# Altium schematic sheet Anemoia-ESP32-SMD.SchDoc: Anemoia-ESP32 (part 2 of 3)
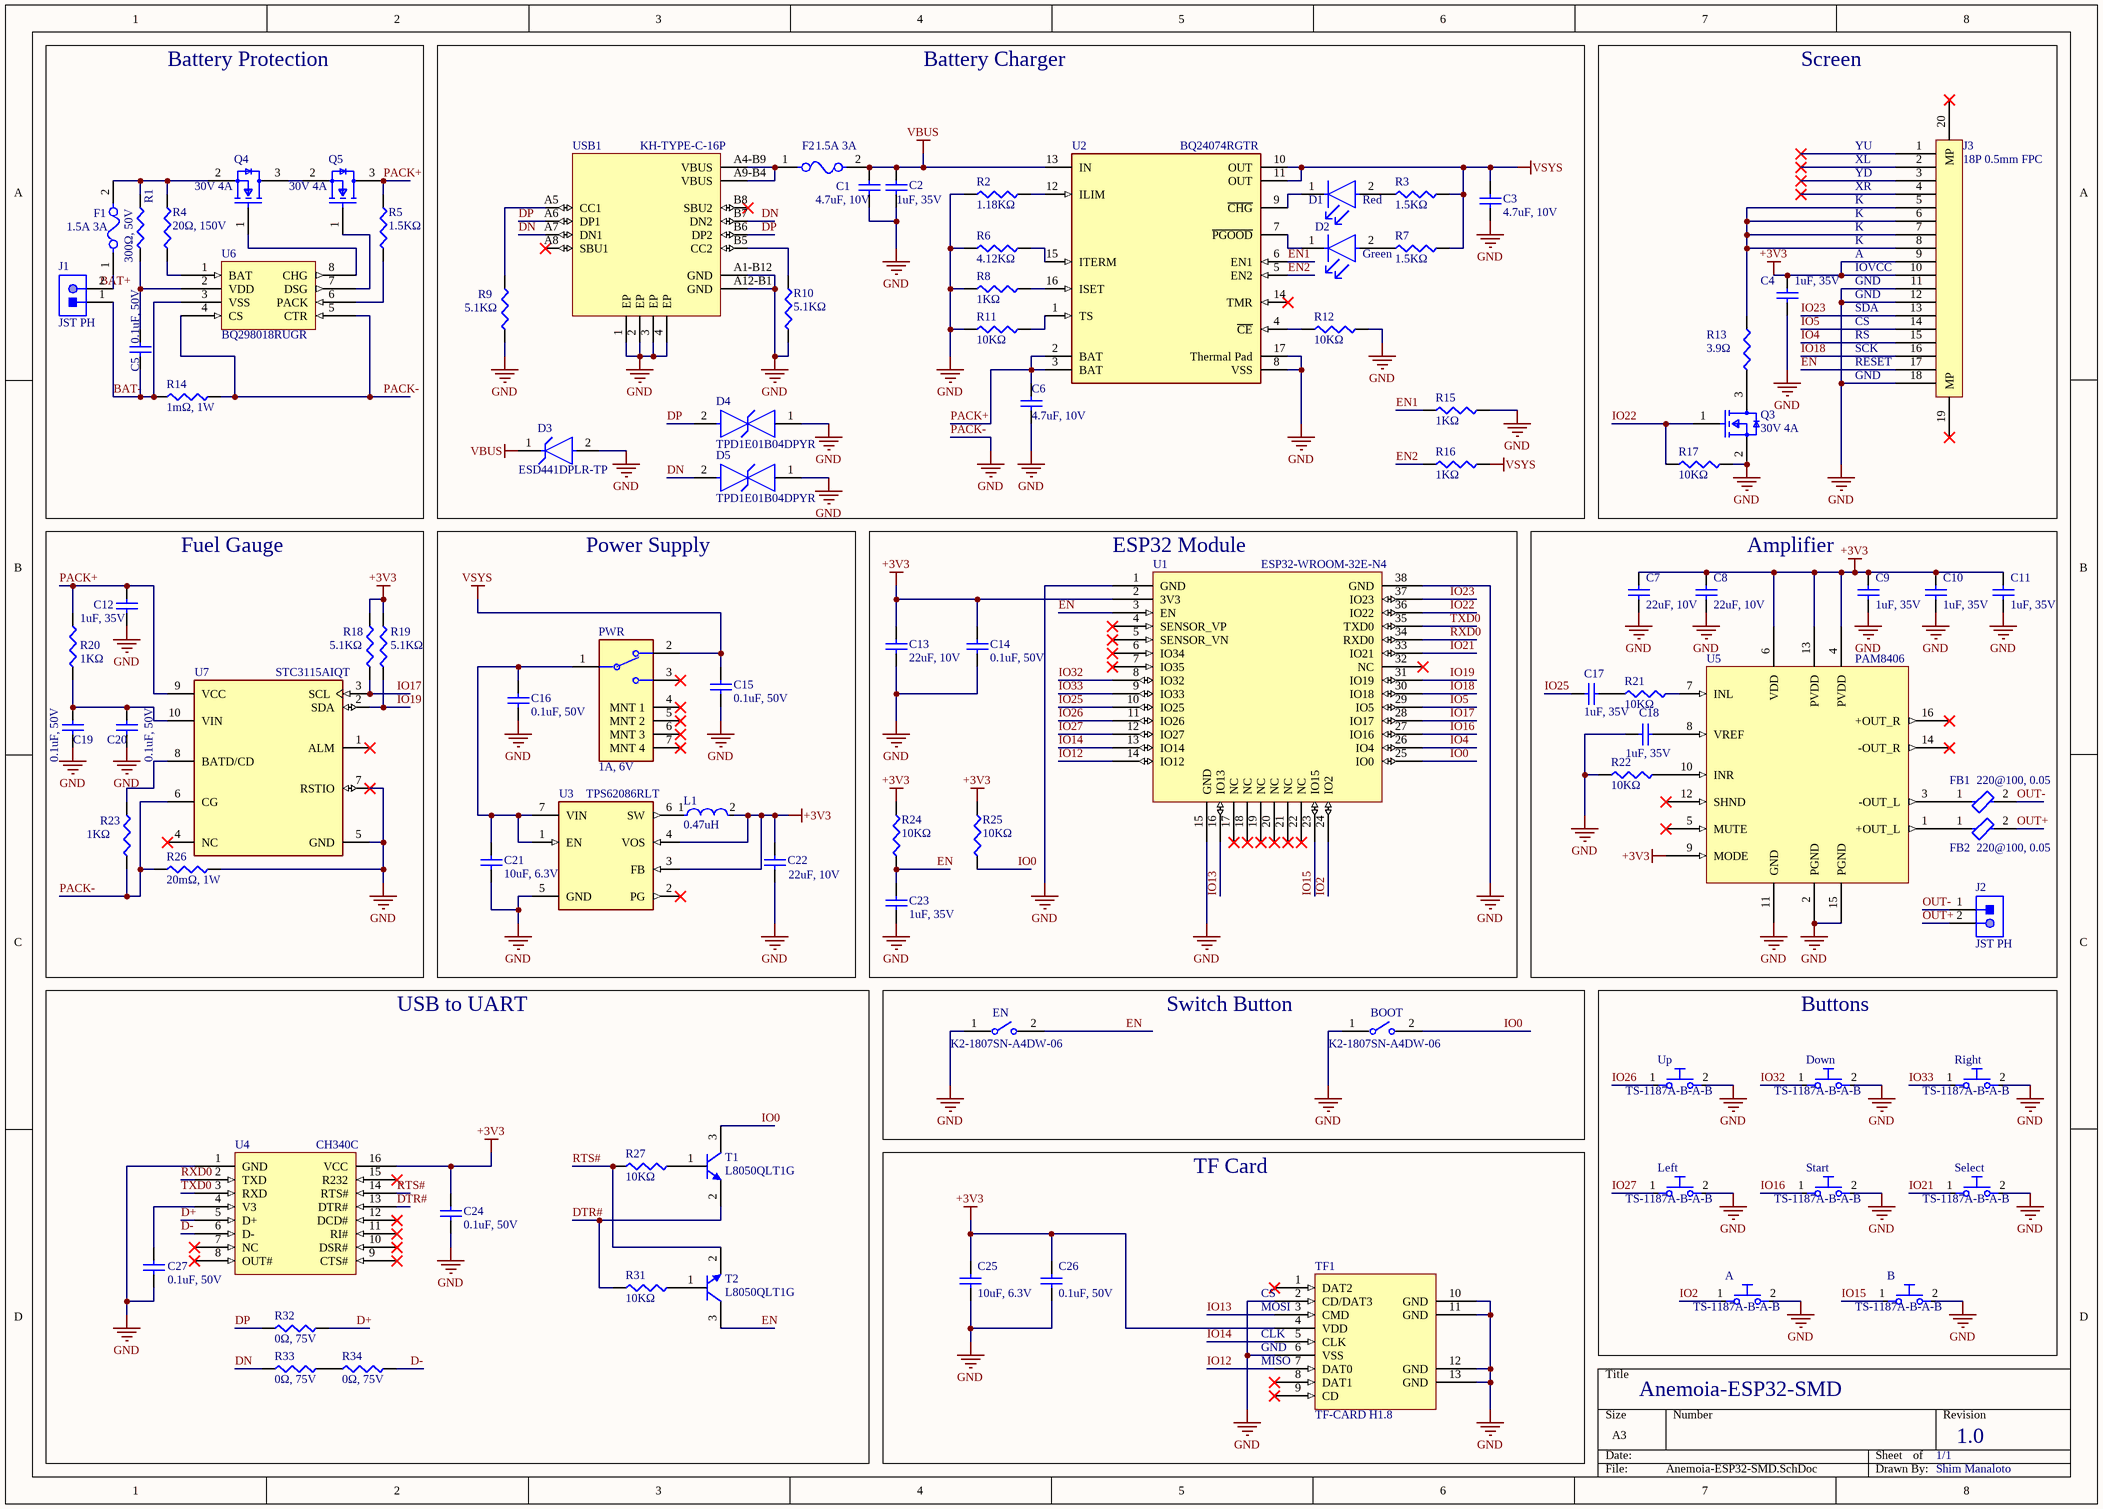
[diagram p1: Anemoia-ESP32-SMD.SchDoc]
## Library data of the parts
A B Down Left Right Select Start Up = TS-1187A-B-A-B: Without Bracket 5.1mm 12V 5.1mm Round Button No SPST 50mA SMD-4P,5.1x5.1mm Tactile Switches RoHS
BOOT EN = K2-1807SN-A4DW-06: 12V 2.9mm 4mm 50mA SMD,4x2.9mm Tactile Switches RoHS
C1 C3 C6 = CL10A475KP8NNNC: CAP CER 4.7uF 10V ±10% X5R 0603; Manufacturer: Samsung Electro-Mechanics; Capacitance: 4.7µF; Dielectric Material: Ceramic; Supplier 1: DigiKey; Manufacturer Part Number: CL10A475KP8NNNC; RoHS: Compliant; Category: Ceramic Capacitors; Stock 1: 3890805; Case/Package: 0603; Case Code (Imperial): 0603; Case Code (Metric): 1608; China RoHS: Compliant; Contact Plating: Tin; Depth: 800µm; Dielectric: X5R; Height: 800µm; Length: 1.6mm; Lifecycle Status: Production; Material: Ceramic; Max Operating Temperature: 85°C; Min Operating Temperature: -55°C; Mount: Surface Mount; Number of Terminals: 2; Radiation Hardening: No; REACH SVHC: Yes; Schedule B: 8532240020, 8532240020|8532240020|8532240020|8532240020|8532240020|8532240020|8532240020|8532240020|8532240020|8532240020|8532240020|8532240020|8532240020|8532240020|8532240020|8532240020|8532240020|8532240020|8532240020|8532240020|8532240020|8532240020|8532240020|85; Thickness: 889µm; Tolerance: 10%; Voltage Rating: 10V; Voltage Rating (DC): 10V; Width: 800µm; ComponentLink1URL: https://datasheet.octopart.com:443/CL10A475KP8NNNC-Samsung-Electro-Mechanics-datasheet-141347107.pdf?src-supplier=IHS; ComponentLink1Description: https://datasheet.octopart.com:443/CL10A475KP8NNNC-Samsung-Electro-Mechanics-datasheet-141347107.pdf?src-supplier=IHS; ComponentLink2URL: https://datasheet.octopart.com/CL10A475KP8NNNC-Samsung-Electro-Mechanics-datasheet-8324245.pdf; ComponentLink2Description: https://datasheet.octopart.com/CL10A475KP8NNNC-Samsung-Electro-Mechanics-datasheet-8324245.pdf; ComponentLink3URL: https://datasheet.octopart.com/CL10A475KP8NNNC-Samsung-Electro-Mechanics-datasheet-97040617.pdf; ComponentLink3Description: https://datasheet.octopart.com/CL10A475KP8NNNC-Samsung-Electro-Mechanics-datasheet-97040617.pdf; ComponentLink4URL: https://datasheet.octopart.com:443/CL10A475KP8NNNC-Samsung-Electro-Mechanics-datasheet-110226306.pdf?src-supplier=Future+Electronics; ComponentLink4Description: https://datasheet.octopart.com:443/CL10A475KP8NNNC-Samsung-Electro-Mechanics-datasheet-110226306.pdf?src-supplier=Future+Electronics; ComponentLink5URL: https://datasheet.octopart.com:443/CL10A475KP8NNNC-Samsung-Electro-Mechanics-datasheet-81461812.pdf?src-supplier=Future+Electronics; ComponentLink5Description: https://datasheet.octopart.com:443/CL10A475KP8NNNC-Samsung-Electro-Mechanics-datasheet-81461812.pdf?src-supplier=Future+Electronics; ComponentLink6URL: https://datasheet.octopart.com:443/CL10A475KP8NNNC-Samsung-datasheet-44382860.pdf?src-supplier=Future+Electronics; ComponentLink6Description: https://datasheet.octopart.com:443/CL10A475KP8NNNC-Samsung-datasheet-44382860.pdf?src-supplier=Future+Electronics; ComponentLink7URL: https://datasheet.octopart.com:443/CL10A475KP8NNNC-Samsung-datasheet-26589134.pdf?src-supplier=Future+Electronics; ComponentLink7Description: https://datasheet.octopart.com:443/CL10A475KP8NNNC-Samsung-datasheet-26589134.pdf?src-supplier=Future+Electronics; ComponentLink8URL: https://datasheet.octopart.com:443/CL10A475KP8NNNC-Samsung-Electro-Mechanics-datasheet-149158807.pdf?src-supplier=Future+Electronics; ComponentLink8Description: https://datasheet.octopart.com:443/CL10A475KP8NNNC-Samsung-Electro-Mechanics-datasheet-149158807.pdf?src-supplier=Future+Electronics; ComponentLink9URL: https://datasheet.octopart.com:443/CL10A475KP8NNNC-Samsung-datasheet-59220082.pdf?src-supplier=TME; ComponentLink9Description: https://datasheet.octopart.com:443/CL10A475KP8NNNC-Samsung-datasheet-59220082.pdf?src-supplier=TME; ComponentLink10URL: https://datasheet.octopart.com:443/CL10A475KP8NNNC-Samsung-Electro-Mechanics-datasheet-11791968.pdf?src-supplier=Arrow+Electronics; ComponentLink10Description: https://datasheet.octopart.com:443/CL10A475KP8NNNC-Samsung-Electro-Mechanics-datasheet-11791968.pdf?src-supplier=Arrow+Electronics
C2 C4 C9-C12 C17 C18 C23 = CL05A105KL5NRNC: CAP CER 1uF 35V ±10% X5R 0402; Manufacturer: Samsung Electro-Mechanics; Manufacturer Part Number: CL05A105KP5NNNC; Capacitance: 1µF; Dielectric Material: Ceramic; Voltage Rating: 10V; Supplier 1: DigiKey; RoHS: Compliant; Category: Ceramic Capacitors; Stock 1: 2577830; Case/Package: 0402; Case Code (Imperial): 0402; Case Code (Metric): 1005; China RoHS: Compliant; Contact Plating: Tin; Depth: 500µm; Dielectric: X5R; Height: 550µm; Length: 1mm; Lifecycle Status: Production; Material: Ceramic; Max Operating Temperature: 85°C; Min Operating Temperature: -55°C; Mount: Surface Mount; Number of Terminals: 2; Radiation Hardening: No; REACH SVHC: Yes; Schedule B: 8532240020, 8532240020|8532240020|8532240020|8532240020|8532240020, 8532240020|8532240020|8532240020|8532240020|8532240020|8532240020, 8532240020|8532240020|8532240020|8532240020|8532240020|8532240020|8532240020; Thickness: 558.8µm; Tolerance: 10%; Voltage Rating (DC): 10V; Width: 500µm; ComponentLink1URL: https://datasheet.octopart.com:443/CL05A105KP5NNNC-Samsung-Electro-Mechanics-datasheet-181960517.pdf?src-supplier=IHS; ComponentLink1Description: https://datasheet.octopart.com:443/CL05A105KP5NNNC-Samsung-Electro-Mechanics-datasheet-181960517.pdf?src-supplier=IHS; ComponentLink2URL: https://datasheet.octopart.com:443/CL05A105KP5NNNC-Samsung-Electro-Mechanics-datasheet-136031721.pdf?src-supplier=Future+Electronics; ComponentLink2Description: https://datasheet.octopart.com:443/CL05A105KP5NNNC-Samsung-Electro-Mechanics-datasheet-136031721.pdf?src-supplier=Future+Electronics; ComponentLink3URL: https://datasheet.octopart.com:443/CL05A105KP5NNNC-Samsung-Electro-Mechanics-datasheet-110226203.pdf?src-supplier=Future+Electronics; ComponentLink3Description: https://datasheet.octopart.com:443/CL05A105KP5NNNC-Samsung-Electro-Mechanics-datasheet-110226203.pdf?src-supplier=Future+Electronics; ComponentLink4URL: https://datasheet.octopart.com:443/CL05A105KP5NNNC-Samsung-Electro-Mechanics-datasheet-81461591.pdf?src-supplier=Future+Electronics; ComponentLink4Description: https://datasheet.octopart.com:443/CL05A105KP5NNNC-Samsung-Electro-Mechanics-datasheet-81461591.pdf?src-supplier=Future+Electronics; ComponentLink5URL: https://datasheet.octopart.com:443/CL05A105KP5NNNC-Samsung-datasheet-42280521.pdf?src-supplier=Future+Electronics; ComponentLink5Description: https://datasheet.octopart.com:443/CL05A105KP5NNNC-Samsung-datasheet-42280521.pdf?src-supplier=Future+Electronics; ComponentLink6URL: https://datasheet.octopart.com:443/CL05A105KP5NNNC-Samsung-datasheet-26589000.pdf?src-supplier=Future+Electronics; ComponentLink6Description: https://datasheet.octopart.com:443/CL05A105KP5NNNC-Samsung-datasheet-26589000.pdf?src-supplier=Future+Electronics; ComponentLink7URL: https://datasheet.octopart.com:443/CL05A105KP5NNNC-Samsung-datasheet-8326907.pdf?src-supplier=Future+Electronics; ComponentLink7Description: https://datasheet.octopart.com:443/CL05A105KP5NNNC-Samsung-datasheet-8326907.pdf?src-supplier=Future+Electronics; ComponentLink8URL: https://datasheet.octopart.com:443/CL05A105KP5NNNC-Samsung-Electro-Mechanics-datasheet-149136634.pdf?src-supplier=Future+Electronics; ComponentLink8Description: https://datasheet.octopart.com:443/CL05A105KP5NNNC-Samsung-Electro-Mechanics-datasheet-149136634.pdf?src-supplier=Future+Electronics; ComponentLink9URL: https://datasheet.octopart.com/CL05A105KP5NNNC-Samsung-Electro-Mechanics-datasheet-97040617.pdf; ComponentLink9Description: https://datasheet.octopart.com/CL05A105KP5NNNC-Samsung-Electro-Mechanics-datasheet-97040617.pdf; ComponentLink10URL: https://datasheet.octopart.com/CL05A105KP5NNNC-Samsung-Electro-Mechanics-datasheet-8324245.pdf; ComponentLink10Description: https://datasheet.octopart.com/CL05A105KP5NNNC-Samsung-Electro-Mechanics-datasheet-8324245.pdf; ComponentLink11URL: https://datasheet.octopart.com:443/CL05A105KP5NNNC-Samsung-Electro-Mechanics-datasheet-11789578.pdf?src-supplier=Arrow+Electronics; ComponentLink11Description: https://datasheet.octopart.com:443/CL05A105KP5NNNC-Samsung-Electro-Mechanics-datasheet-11789578.pdf?src-supplier=Arrow+Electronics; ComponentLink12URL: https://datasheet.octopart.com:443/CL05A105KP5NNNC-Samsung-datasheet-59220082.pdf?src-supplier=TME; ComponentLink12Description: https://datasheet.octopart.com:443/CL05A105KP5NNNC-Samsung-datasheet-59220082.pdf?src-supplier=TME
C5 C14-C16 C19 C20 C24 C26 C27 = CC0603KRX7R9BB104: CAP CER 0.1UF 50V X7R 0603; Manufacturer: Yageo Group; Capacitance: 100nF; Dielectric Material: Ceramic; Tolerance: 10%; Supplier 1: DigiKey; Manufacturer Part Number: CC0603KRX7R9BB104; RoHS: Compliant; Category: Ceramic Capacitors; Stock 1: 2259638; Case/Package: 0603; Case Code (Imperial): 0603; Case Code (Metric): 1608; China RoHS: Compliant; Depth: 800µm; Dielectric: X7R; Halogen Free: Halogen Free; Height: 800µm; Lead Free: Lead Free; Length: 1.6mm; Lifecycle Status: Production; Material: Ceramic; Max Operating Temperature: 125°C; Min Operating Temperature: -55°C; Mount: Surface Mount; Number of Pins: 2; Number of Terminals: 2; Radiation Hardening: No; REACH SVHC: Yes; Schedule B: 8532240020, 8532240020|8532240020, 8532240020|8532240020|8532240020, 8532240020|8532240020|8532240020|8532240020; Termination: SMD/SMT; Thickness: 889µm; Voltage: 50V; Voltage Rating: 50V; Voltage Rating (DC): 50V; Width: 800µm; ComponentLink1URL: https://datasheet.octopart.com:443/CC0603KRX7R9BB104-Yageo-datasheet-177165144.pdf?src-supplier=IHS; ComponentLink1Description: https://datasheet.octopart.com:443/CC0603KRX7R9BB104-Yageo-datasheet-177165144.pdf?src-supplier=IHS; ComponentLink2URL: https://datasheet.octopart.com:443/CC0603KRX7R9BB104-Yageo-datasheet-82288757.pdf?src-supplier=Upverter; ComponentLink2Description: https://datasheet.octopart.com:443/CC0603KRX7R9BB104-Yageo-datasheet-82288757.pdf?src-supplier=Upverter; ComponentLink3URL: https://datasheet.octopart.com:443/CC0603KRX7R9BB104-Yageo-datasheet-68298032.pdf?src-supplier=Upverter; ComponentLink3Description: https://datasheet.octopart.com:443/CC0603KRX7R9BB104-Yageo-datasheet-68298032.pdf?src-supplier=Upverter; ComponentLink4URL: https://datasheet.octopart.com/CC0603KRX7R9BB104-Yageo-datasheet-10883670.pdf; ComponentLink4Description: https://datasheet.octopart.com/CC0603KRX7R9BB104-Yageo-datasheet-10883670.pdf; ComponentLink5URL: https://datasheet.octopart.com/CC0603KRX7R9BB104-Yageo-datasheet-12526321.pdf; ComponentLink5Description: https://datasheet.octopart.com/CC0603KRX7R9BB104-Yageo-datasheet-12526321.pdf; ComponentLink6URL: https://datasheet.octopart.com:443/CC0603KRX7R9BB104-Yageo-datasheet-181968726.pdf?src-supplier=Newark; ComponentLink6Description: https://datasheet.octopart.com:443/CC0603KRX7R9BB104-Yageo-datasheet-181968726.pdf?src-supplier=Newark; ComponentLink7URL: https://datasheet.octopart.com:443/CC0603KRX7R9BB104-Yageo-datasheet-499490.pdf?src-supplier=Newark; ComponentLink7Description: https://datasheet.octopart.com:443/CC0603KRX7R9BB104-Yageo-datasheet-499490.pdf?src-supplier=Newark; ComponentLink8URL: https://datasheet.octopart.com:443/CC0603KRX7R9BB104-Yageo-datasheet-62336348.pdf?src-supplier=Newark; ComponentLink8Description: https://datasheet.octopart.com:443/CC0603KRX7R9BB104-Yageo-datasheet-62336348.pdf?src-supplier=Newark; ComponentLink9URL: https://datasheet.octopart.com:443/CC0603KRX7R9BB104-Yageo-datasheet-147453679.pdf?src-supplier=Newark; ComponentLink9Description: https://datasheet.octopart.com:443/CC0603KRX7R9BB104-Yageo-datasheet-147453679.pdf?src-supplier=Newark; ComponentLink10URL: https://datasheet.octopart.com:443/CC0603KRX7R9BB104-Yageo-datasheet-151948686.pdf?src-supplier=Farnell; ComponentLink10Description: https://datasheet.octopart.com:443/CC0603KRX7R9BB104-Yageo-datasheet-151948686.pdf?src-supplier=Farnell; ComponentLink11URL: https://datasheet.octopart.com:443/CC0603KRX7R9BB104-Yageo-datasheet-500777.pdf?src-supplier=Farnell; ComponentLink11Description: https://datasheet.octopart.com:443/CC0603KRX7R9BB104-Yageo-datasheet-500777.pdf?src-supplier=Farnell; ComponentLink12URL: https://datasheet.octopart.com:443/CC0603KRX7R9BB104-Yageo-datasheet-166511530.pdf?src-supplier=Future+Electronics; ComponentLink12Description: https://datasheet.octopart.com:443/CC0603KRX7R9BB104-Yageo-datasheet-166511530.pdf?src-supplier=Future+Electronics; ComponentLink13URL: https://datasheet.octopart.com:443/CC0603KRX7R9BB104-Yageo-datasheet-137700082.pdf?src-supplier=Future+Electronics; ComponentLink13Description: https://datasheet.octopart.com:443/CC0603KRX7R9BB104-Yageo-datasheet-137700082.pdf?src-supplier=Future+Electronics; ComponentLink14URL: https://datasheet.octopart.com:443/CC0603KRX7R9BB104-Yageo-datasheet-137700084.pdf?src-supplier=Future+Electronics; ComponentLink14Description: https://datasheet.octopart.com:443/CC0603KRX7R9BB104-Yageo-datasheet-137700084.pdf?src-supplier=Future+Electronics; ComponentLink15URL: https://datasheet.octopart.com:443/CC0603KRX7R9BB104-Yageo-datasheet-27626582.pdf?src-supplier=Future+Electronics; ComponentLink15Description: https://datasheet.octopart.com:443/CC0603KRX7R9BB104-Yageo-datasheet-27626582.pdf?src-supplier=Future+Electronics; ComponentLink16URL: https://datasheet.octopart.com:443/CC0603KRX7R9BB104-Yageo-datasheet-15895757.pdf?src-supplier=Future+Electronics; ComponentLink16Description: https://datasheet.octopart.com:443/CC0603KRX7R9BB104-Yageo-datasheet-15895757.pdf?src-supplier=Future+Electronics; ComponentLink17URL: https://datasheet.octopart.com:443/CC0603KRX7R9BB104-Yageo-datasheet-8324192.pdf?src-supplier=Future+Electronics; ComponentLink17Description: https://datasheet.octopart.com:443/CC0603KRX7R9BB104-Yageo-datasheet-8324192.pdf?src-supplier=Future+Electronics; ComponentLink18URL: https://datasheet.octopart.com:443/CC0603KRX7R9BB104-Yageo-datasheet-178019014.pdf?src-supplier=Burklin+Elektronik; ComponentLink18Description: https://datasheet.octopart.com:443/CC0603KRX7R9BB104-Yageo-datasheet-178019014.pdf?src-supplier=Burklin+Elektronik; ComponentLink19URL: https://datasheet.octopart.com:443/CC0603KRX7R9BB104-Yageo-Group-datasheet-165992755.pdf?src-supplier=ODG+(Origin+Data+Global); ComponentLink19Description: https://datasheet.octopart.com:443/CC0603KRX7R9BB104-Yageo-Group-datasheet-165992755.pdf?src-supplier=ODG+(Origin+Data+Global); ComponentLink20URL: https://datasheet.octopart.com:443/CC0603KRX7R9BB104-Yageo-datasheet-140260305.pdf?src-supplier=SOS+electronic; ComponentLink20Description: https://datasheet.octopart.com:443/CC0603KRX7R9BB104-Yageo-datasheet-140260305.pdf?src-supplier=SOS+electronic; ComponentLink21URL: https://datasheet.octopart.com:443/CC0603KRX7R9BB104-Yageo-datasheet-120101875.pdf?src-supplier=Megastar; ComponentLink21Description: https://datasheet.octopart.com:443/CC0603KRX7R9BB104-Yageo-datasheet-120101875.pdf?src-supplier=Megastar; ComponentLink22URL: https://datasheet.octopart.com:443/CC0603KRX7R9BB104-Yageo-datasheet-8701427.pdf?src-supplier=element14; ComponentLink22Description: https://datasheet.octopart.com:443/CC0603KRX7R9BB104-Yageo-datasheet-8701427.pdf?src-supplier=element14; ComponentLink23URL: https://datasheet.octopart.com:443/CC0603KRX7R9BB104-Yageo-datasheet-5301394.pdf?src-supplier=element14; ComponentLink23Description: https://datasheet.octopart.com:443/CC0603KRX7R9BB104-Yageo-datasheet-5301394.pdf?src-supplier=element14; ComponentLink24URL: https://datasheet.octopart.com:443/CC0603KRX7R9BB104-Yageo-datasheet-17600895.pdf?src-supplier=TME; ComponentLink24Description: https://datasheet.octopart.com:443/CC0603KRX7R9BB104-Yageo-datasheet-17600895.pdf?src-supplier=TME; ComponentLink25URL: http://sigma.octopart.com:80/15889575/rohs_statement/Yageo-CC0603KRX7R9BB104.pdf?src-supplier=Compliance+Statements; ComponentLink25Description: http://sigma.octopart.com:80/15889575/rohs_statement/Yageo-CC0603KRX7R9BB104.pdf?src-supplier=Compliance+Statements; ComponentLink26URL: http://sigma.octopart.com:80/rohs_statement/Surface-Mount-Ceramic-Multilayer-Capacitors%3B-General-Purpose-%26-High-Capacitance-Class-2%2C-X7R-Yageo-family-124.pdf?src-supplier=Compliance+Statements; ComponentLink26Description: http://sigma.octopart.com:80/rohs_statement/Surface-Mount-Ceramic-Multilayer-Capacitors%3B-General-Purpose-%26-High-Capacitance-Class-2%2C-X7R-Yageo-family-124.pdf?src-supplier=Compliance+Statements; ComponentLink27URL: http://sigma.octopart.com:80/reach_statement/Surface-Mount-Ceramic-Multilayer-Capacitors%3B-General-Purpose-%26-High-Capacitance-Class-2%2C-X7R-Yageo-family-125.pdf?src-supplier=Compliance+Statements; ComponentLink27Description: http://sigma.octopart.com:80/reach_statement/Surface-Mount-Ceramic-Multilayer-Capacitors%3B-General-Purpose-%26-High-Capacitance-Class-2%2C-X7R-Yageo-family-125.pdf?src-supplier=Compliance+Statements; ComponentLink28URL: http://sigma.octopart.com:80/conflict_mineral_statement/Yageo-company-3.pdf?src-supplier=Compliance+Statements; ComponentLink28Description: http://sigma.octopart.com:80/conflict_mineral_statement/Yageo-company-3.pdf?src-supplier=Compliance+Statements
C7 C8 C13 C22 = GRM188R61A226ME15D: CAP CER 22UF 10V X5R 0603; Manufacturer: Murata; Manufacturer Lifecycle Status: IN PRODUCTION; Capacitance: 22µF; Dielectric Material: Ceramic; Tolerance: 20%; Supplier 1: DigiKey; Manufacturer Part Number: GRM188R61A226ME15D; RoHS: Compliant; Category: Ceramic Capacitors; Stock 1: 1939170; Case/Package: 0603; Case Code (Imperial): 0603; Case Code (Metric): 1608; Depth: 800µm; Dielectric: X5R; Height: 800µm; Lead Free: Lead Free; Length: 1.6mm; Lifecycle Status: Production; Material: Ceramic; Max Operating Temperature: 85°C; Min Operating Temperature: -55°C; Mount: Surface Mount; Number of Terminals: 2; REACH SVHC: Yes; Schedule B: 8532240020, 8532240020|8532240020|8532240020|8532240020|8532240020|8532240020|8532240020|8532240020|8532240020|8532240020|8532240020|8532240020|8532240020|8532240020|8532240020|8532240020|8532240020|8532240020|8532240020|8532240020|8532240020|8532240020|8532240020|85; Termination: SMD/SMT; Thickness: 800µm; Voltage Rating: 10V; Voltage Rating (DC): 10V; Weight: 6.293594mg; Width: 800µm; ComponentLink1URL: https://datasheet.octopart.com:443/GRM188R61A226ME15D-Murata-datasheet-27203393.pdf?src-supplier=Newark; ComponentLink1Description: https://datasheet.octopart.com:443/GRM188R61A226ME15D-Murata-datasheet-27203393.pdf?src-supplier=Newark; ComponentLink2URL: https://datasheet.octopart.com:443/GRM188R61A226ME15D-Murata-datasheet-62317190.pdf?src-supplier=element14+APAC; ComponentLink2Description: https://datasheet.octopart.com:443/GRM188R61A226ME15D-Murata-datasheet-62317190.pdf?src-supplier=element14+APAC; ComponentLink3URL: https://datasheet.octopart.com:443/GRM188R61A226ME15D-Murata-datasheet-165579666.pdf?src-supplier=TME; ComponentLink3Description: https://datasheet.octopart.com:443/GRM188R61A226ME15D-Murata-datasheet-165579666.pdf?src-supplier=TME; ComponentLink4URL: https://datasheet.octopart.com:443/GRM188R61A226ME15D-Murata-datasheet-81639591.pdf?src-supplier=TME; ComponentLink4Description: https://datasheet.octopart.com:443/GRM188R61A226ME15D-Murata-datasheet-81639591.pdf?src-supplier=TME; ComponentLink5URL: https://datasheet.octopart.com:443/GRM188R61A226ME15D-Murata-datasheet-141274968.pdf?src-supplier=Ciiva; ComponentLink5Description: https://datasheet.octopart.com:443/GRM188R61A226ME15D-Murata-datasheet-141274968.pdf?src-supplier=Ciiva; ComponentLink6URL: https://datasheet.octopart.com:443/GRM188R61A226ME15D-Murata-datasheet-140704447.pdf?src-supplier=Ciiva; ComponentLink6Description: https://datasheet.octopart.com:443/GRM188R61A226ME15D-Murata-datasheet-140704447.pdf?src-supplier=Ciiva; ComponentLink7URL: https://datasheet.octopart.com:443/GRM188R61A226ME15D-Murata-datasheet-138742833.pdf?src-supplier=Ciiva; ComponentLink7Description: https://datasheet.octopart.com:443/GRM188R61A226ME15D-Murata-datasheet-138742833.pdf?src-supplier=Ciiva; ComponentLink8URL: https://datasheet.octopart.com/GRM188R61A226ME15D-Murata-datasheet-12515295.pdf; ComponentLink8Description: https://datasheet.octopart.com/GRM188R61A226ME15D-Murata-datasheet-12515295.pdf; ComponentLink9URL: https://datasheet.octopart.com/GRM188R61A226ME15D-Murata-datasheet-12510076.pdf; ComponentLink9Description: https://datasheet.octopart.com/GRM188R61A226ME15D-Murata-datasheet-12510076.pdf; ComponentLink10URL: https://datasheet.octopart.com/GRM188R61A226ME15D-Murata-datasheet-11978611.pdf; ComponentLink10Description: https://datasheet.octopart.com/GRM188R61A226ME15D-Murata-datasheet-11978611.pdf; ComponentLink11URL: https://datasheet.octopart.com/GRM188R61A226ME15D-Murata-datasheet-10025737.pdf; ComponentLink11Description: https://datasheet.octopart.com/GRM188R61A226ME15D-Murata-datasheet-10025737.pdf; ComponentLink12URL: https://datasheet.octopart.com/GRM188R61A226ME15D-Murata-datasheet-8819587.pdf; ComponentLink12Description: https://datasheet.octopart.com/GRM188R61A226ME15D-Murata-datasheet-8819587.pdf; ComponentLink13URL: https://datasheet.octopart.com/GRM188R61A226ME15D-Murata-datasheet-38883270.pdf; ComponentLink13Description: https://datasheet.octopart.com/GRM188R61A226ME15D-Murata-datasheet-38883270.pdf; ComponentLink14URL: https://datasheet.octopart.com:443/GRM188R61A226ME15D-Murata-datasheet-62287447.pdf?src-supplier=Future+Electronics; ComponentLink14Description: https://datasheet.octopart.com:443/GRM188R61A226ME15D-Murata-datasheet-62287447.pdf?src-supplier=Future+Electronics; ComponentLink15URL: http://sigma.octopart.com:80/reach_statement/Murata-company-16.pdf?src-supplier=Compliance+Statements; ComponentLink15Description: http://sigma.octopart.com:80/reach_statement/Murata-company-16.pdf?src-supplier=Compliance+Statements
C21 C25 = CL05A106MQ5NUNC: 6.3V 10uF X5R ±20% 0402 Ceramic Capacitors RoHS; Manufacturer: Samsung Electro-Mechanics; Capacitance: 10µF; Supplier 1: DigiKey; Manufacturer Part Number: CL05A106MQ5NUNC; RoHS: Compliant; Category: Ceramic Capacitors; Stock 1: 3519014; Case/Package: 0402; Case Code (Imperial): 0402; Case Code (Metric): 1005; China RoHS: Compliant; Depth: 500µm; Dielectric: X5R; Dielectric Material: Ceramic; Height: 700µm; Length: 1mm; Lifecycle Status: Production; Max Operating Temperature: 85°C; Min Operating Temperature: -55°C; Mount: Surface Mount; Number of Terminals: 2; Radiation Hardening: No; REACH SVHC: Yes; Schedule B: 8532240020, 8532240020|8532240020, 8532240020|8532240020|8532240020, 8532240020|8532240020|8532240020|8532240020; Thickness: 711.2µm; Tolerance: 20%; Voltage Rating: 6.3V; Voltage Rating (DC): 6.3V; Width: 500µm; ComponentLink1URL: https://datasheet.octopart.com:443/CL05A106MQ5NUNC-Samsung-Electro-Mechanics-datasheet-136031724.pdf?src-supplier=Newark; ComponentLink1Description: https://datasheet.octopart.com:443/CL05A106MQ5NUNC-Samsung-Electro-Mechanics-datasheet-136031724.pdf?src-supplier=Newark; ComponentLink2URL: https://datasheet.octopart.com:443/CL05A106MQ5NUNC-Samsung-Electro-Mechanics-datasheet-181551184.pdf?src-supplier=Newark; ComponentLink2Description: https://datasheet.octopart.com:443/CL05A106MQ5NUNC-Samsung-Electro-Mechanics-datasheet-181551184.pdf?src-supplier=Newark; ComponentLink3URL: https://datasheet.octopart.com:443/CL05A106MQ5NUNC-Samsung-Electro-Mechanics-datasheet-110226207.pdf?src-supplier=Future+Electronics; ComponentLink3Description: https://datasheet.octopart.com:443/CL05A106MQ5NUNC-Samsung-Electro-Mechanics-datasheet-110226207.pdf?src-supplier=Future+Electronics; ComponentLink4URL: https://datasheet.octopart.com:443/CL05A106MQ5NUNC-Samsung-Electro-Mechanics-datasheet-81461596.pdf?src-supplier=Future+Electronics; ComponentLink4Description: https://datasheet.octopart.com:443/CL05A106MQ5NUNC-Samsung-Electro-Mechanics-datasheet-81461596.pdf?src-supplier=Future+Electronics; ComponentLink5URL: https://datasheet.octopart.com:443/CL05A106MQ5NUNC-Samsung-datasheet-42280528.pdf?src-supplier=Future+Electronics; ComponentLink5Description: https://datasheet.octopart.com:443/CL05A106MQ5NUNC-Samsung-datasheet-42280528.pdf?src-supplier=Future+Electronics; ComponentLink6URL: https://datasheet.octopart.com:443/CL05A106MQ5NUNC-Samsung-datasheet-34153003.pdf?src-supplier=Future+Electronics; ComponentLink6Description: https://datasheet.octopart.com:443/CL05A106MQ5NUNC-Samsung-datasheet-34153003.pdf?src-supplier=Future+Electronics; ComponentLink7URL: https://datasheet.octopart.com:443/CL05A106MQ5NUNC-Samsung-datasheet-26589001.pdf?src-supplier=Future+Electronics; ComponentLink7Description: https://datasheet.octopart.com:443/CL05A106MQ5NUNC-Samsung-datasheet-26589001.pdf?src-supplier=Future+Electronics; ComponentLink8URL: https://datasheet.octopart.com:443/CL05A106MQ5NUNC-Samsung-datasheet-12538126.pdf?src-supplier=Future+Electronics; ComponentLink8Description: https://datasheet.octopart.com:443/CL05A106MQ5NUNC-Samsung-datasheet-12538126.pdf?src-supplier=Future+Electronics; ComponentLink9URL: https://datasheet.octopart.com:443/CL05A106MQ5NUNC-Samsung-Electro-Mechanics-datasheet-149136671.pdf?src-supplier=Future+Electronics; ComponentLink9Description: https://datasheet.octopart.com:443/CL05A106MQ5NUNC-Samsung-Electro-Mechanics-datasheet-149136671.pdf?src-supplier=Future+Electronics; ComponentLink10URL: https://datasheet.octopart.com:443/CL05A106MQ5NUNC-Samsung-datasheet-59220082.pdf?src-supplier=TME; ComponentLink10Description: https://datasheet.octopart.com:443/CL05A106MQ5NUNC-Samsung-datasheet-59220082.pdf?src-supplier=TME
D1 = XL-1608SURC-06: LED RED WATER CLEAR 0603 SMD
D2 = PSC-1608U52GC-G4: LED GREEN WATER CLEAR 0603 SMD
D3 = ESD441DPLR-TP: ESD DIODE 5.5VWM 20VC DFN0603-2
D4 D5 = TPD1E01B04DPYR: 3.6VWM 9VC X1SON-2(0.6x1)
F1 F2 = 1812L150/24MR: 24V 1.5A 20A 3A 40mΩ 1812 PTC Resettable Fuses RoHS; Manufacturer: Littelfuse; Approvals: TUV, cULus; Maximum Resistance 1 Hour (R1max): 120mΩ; Power Dissipation: 800mW; Time to Trip: 1.5s; Supplier 1: DigiKey; Manufacturer Part Number: 1812L150/24MR; RoHS: Compliant; Category: PTC Resettable Fuses; Stock 1: 26082; Ambient Temperature Range High: 85°C; Case/Package: 1812; Case Code (Imperial): 1812; Case Code (Metric): 4532; China RoHS: Compliant; Current Rating: 20A; Height: 1.8mm; Hold Current: 1.5A; Lead Free: Lead Free; Lifecycle Status: Production; Max Current Rating: 20A; Max Operating Temperature: 85°C; Max Voltage Rating (DC): 24V; Min Operating Temperature: -40°C; Minimum Resistance Initial (Rmin): 40mΩ; Mount: Surface Mount; Number of Terminals: 2; Operating Supply Voltage: 24V; REACH SVHC: Yes; Resistance: 40mΩ; Termination: SMD/SMT; Trip Current: 3A; Voltage Rating: 24V; Voltage Rating (DC): 24V; Width: 3.41mm; Working Voltage: 24V; ComponentLink1URL: https://datasheet.octopart.com:443/1812L150-24MR-Littelfuse-datasheet-181956373.pdf?src-supplier=IHS; ComponentLink1Description: https://datasheet.octopart.com:443/1812L150-24MR-Littelfuse-datasheet-181956373.pdf?src-supplier=IHS; ComponentLink2URL: https://datasheet.octopart.com:443/1812L150-24MR-Littelfuse-datasheet-133510347.pdf?src-supplier=Farnell; ComponentLink2Description: https://datasheet.octopart.com:443/1812L150-24MR-Littelfuse-datasheet-133510347.pdf?src-supplier=Farnell; ComponentLink3URL: https://datasheet.octopart.com:443/1812L150/24MR-Littelfuse-datasheet-8701984.pdf?src-supplier=Farnell; ComponentLink3Description: https://datasheet.octopart.com:443/1812L150/24MR-Littelfuse-datasheet-8701984.pdf?src-supplier=Farnell; ComponentLink4URL: https://datasheet.octopart.com:443/1812L150/24MR-Littelfuse-datasheet-11773851.pdf?src-supplier=Farnell; ComponentLink4Description: https://datasheet.octopart.com:443/1812L150/24MR-Littelfuse-datasheet-11773851.pdf?src-supplier=Farnell; ComponentLink5URL: https://datasheet.octopart.com:443/1812L150/24MR-Littelfuse-datasheet-10288713.pdf?src-supplier=Farnell; ComponentLink5Description: https://datasheet.octopart.com:443/1812L150/24MR-Littelfuse-datasheet-10288713.pdf?src-supplier=Farnell; ComponentLink6URL: https://datasheet.octopart.com:443/1812L150/24MR-Littelfuse-datasheet-8499982.pdf?src-supplier=Farnell; ComponentLink6Description: https://datasheet.octopart.com:443/1812L150/24MR-Littelfuse-datasheet-8499982.pdf?src-supplier=Farnell; ComponentLink7URL: https://datasheet.octopart.com:443/1812L150/24MR-Littelfuse-datasheet-8330599.pdf?src-supplier=Farnell; ComponentLink7Description: https://datasheet.octopart.com:443/1812L150/24MR-Littelfuse-datasheet-8330599.pdf?src-supplier=Farnell; ComponentLink8URL: https://datasheet.octopart.com:443/1812L150/24MR-Littelfuse-datasheet-8764218.pdf?src-supplier=element14+APAC; ComponentLink8Description: https://datasheet.octopart.com:443/1812L150/24MR-Littelfuse-datasheet-8764218.pdf?src-supplier=element14+APAC; ComponentLink9URL: https://datasheet.octopart.com:443/1812L150/24MR-Littelfuse-datasheet-14046.pdf?src-supplier=Future+Electronics; ComponentLink9Description: https://datasheet.octopart.com:443/1812L150/24MR-Littelfuse-datasheet-14046.pdf?src-supplier=Future+Electronics; ComponentLink10URL: https://datasheet.octopart.com:443/1812L150-24MR-Littelfuse-datasheet-24577145.pdf?src-supplier=Future+Electronics; ComponentLink10Description: https://datasheet.octopart.com:443/1812L150-24MR-Littelfuse-datasheet-24577145.pdf?src-supplier=Future+Electronics; ComponentLink11URL: https://datasheet.octopart.com:443/1812L150-24MR-Littelfuse-datasheet-183575728.pdf?src-supplier=Sager+Electronics; ComponentLink11Description: https://datasheet.octopart.com:443/1812L150-24MR-Littelfuse-datasheet-183575728.pdf?src-supplier=Sager+Electronics; ComponentLink12URL: https://datasheet.octopart.com:443/1812L150-24MR-Littelfuse-datasheet-175882318.pdf?src-supplier=Sager+Electronics; ComponentLink12Description: https://datasheet.octopart.com:443/1812L150-24MR-Littelfuse-datasheet-175882318.pdf?src-supplier=Sager+Electronics; ComponentLink13URL: https://datasheet.octopart.com:443/1812L150-24MR-Littelfuse-datasheet-177174290.pdf?src-supplier=Burklin+Elektronik; ComponentLink13Description: https://datasheet.octopart.com:443/1812L150-24MR-Littelfuse-datasheet-177174290.pdf?src-supplier=Burklin+Elektronik; ComponentLink14URL: https://datasheet.octopart.com:443/1812L150-24MR-Littelfuse-datasheet-560439.pdf?src-supplier=Fuses+Unlimited; ComponentLink14Description: https://datasheet.octopart.com:443/1812L150-24MR-Littelfuse-datasheet-560439.pdf?src-supplier=Fuses+Unlimited
FB1 FB2 = BLM18EG221SN1D: Chip Ferrite Bead, 0603, 220Ω @ 100MHz, 0.05Ω, 25%, 2A; Manufacturer: Murata; Current Rating: 1A; DC Resistance (DCR): 50mΩ; Impedance: 260Ω; Material: Ferrite, Steel; Max Frequency: 1GHz; Number of Circuits: 1; Supplier 1: DigiKey; Manufacturer Part Number: BLM18EG221SN1D; RoHS: Compliant; Category: Ferrite Beads and Chips; Stock 1: 154402; Case/Package: 0603; Case Code (Imperial): 0603; Case Code (Metric): 1608; Contact Plating: Tin; Core Material: Ferrite; DC Current: 2A; Depth: 800µm; Frequency: 100MHz; Height: 800µm; Lead Free: Lead Free; Length: 1.6mm; Lifecycle Status: Production; Max Current Rating: 2A; Max DC Current: 2A; Max Operating Temperature: 125°C; Military Standard: Not; Min Operating Temperature: -55°C; Number of Lines: 1; Number of Pins: 2; Number of Terminals: 2; Packaging: Cut Tape; Radiation Hardening: No; REACH SVHC: Yes; Resistance: 220Ω; RMS Current (Irms): 2A; Schedule B: 8504500000, 8504500000|8504500000|8504500000|8504500000|8504500000; Series Resistance: 50mΩ; Termination: SMD/SMT; Test Frequency: 100MHz; Tolerance: 25%; Width: 800µm; ComponentLink1URL: https://datasheet.octopart.com:443/BLM18EG221SN1D-Murata-datasheet-180806761.pdf?src-supplier=IHS; ComponentLink1Description: https://datasheet.octopart.com:443/BLM18EG221SN1D-Murata-datasheet-180806761.pdf?src-supplier=IHS; ComponentLink2URL: https://datasheet.octopart.com:443/BLM18EG221SN1D-Murata-datasheet-113093584.pdf?src-supplier=Ciiva; ComponentLink2Description: https://datasheet.octopart.com:443/BLM18EG221SN1D-Murata-datasheet-113093584.pdf?src-supplier=Ciiva; ComponentLink3URL: https://datasheet.octopart.com:443/BLM18EG221SN1D-Murata-datasheet-141257933.pdf?src-supplier=Ciiva; ComponentLink3Description: https://datasheet.octopart.com:443/BLM18EG221SN1D-Murata-datasheet-141257933.pdf?src-supplier=Ciiva; ComponentLink4URL: https://datasheet.octopart.com:443/BLM18EG221SN1D-Murata-datasheet-138706987.pdf?src-supplier=Ciiva; ComponentLink4Description: https://datasheet.octopart.com:443/BLM18EG221SN1D-Murata-datasheet-138706987.pdf?src-supplier=Ciiva; ComponentLink5URL: https://datasheet.octopart.com:443/BLM18EG221SN1D-Murata-datasheet-66919.pdf?src-supplier=element14+APAC; ComponentLink5Description: https://datasheet.octopart.com:443/BLM18EG221SN1D-Murata-datasheet-66919.pdf?src-supplier=element14+APAC; ComponentLink6URL: https://datasheet.octopart.com:443/BLM18EG221SN1D-Murata-datasheet-11550679.pdf?src-supplier=_legacy+Avnet; ComponentLink6Description: https://datasheet.octopart.com:443/BLM18EG221SN1D-Murata-datasheet-11550679.pdf?src-supplier=_legacy+Avnet; ComponentLink7URL: https://datasheet.octopart.com:443/BLM18EG221SN1D-Murata-datasheet-8330444.pdf?src-supplier=_legacy+Avnet; ComponentLink7Description: https://datasheet.octopart.com:443/BLM18EG221SN1D-Murata-datasheet-8330444.pdf?src-supplier=_legacy+Avnet; ComponentLink8URL: https://datasheet.octopart.com:443/BLM18EG221SN1D-Murata-datasheet-584887.pdf?src-supplier=_legacy+Avnet; ComponentLink8Description: https://datasheet.octopart.com:443/BLM18EG221SN1D-Murata-datasheet-584887.pdf?src-supplier=_legacy+Avnet; ComponentLink9URL: https://datasheet.octopart.com:443/BLM18EG221SN1D-Murata-datasheet-135086659.pdf?src-supplier=TME; ComponentLink9Description: https://datasheet.octopart.com:443/BLM18EG221SN1D-Murata-datasheet-135086659.pdf?src-supplier=TME; ComponentLink10URL: https://datasheet.octopart.com:443/BLM18EG221SN1D-Murata-datasheet-151955971.pdf?src-supplier=SOS+electronic; ComponentLink10Description: https://datasheet.octopart.com:443/BLM18EG221SN1D-Murata-datasheet-151955971.pdf?src-supplier=SOS+electronic; ComponentLink11URL: https://datasheet.octopart.com:443/BLM18EG221SN1D-Murata-datasheet-62086310.pdf?src-supplier=Future+Electronics; ComponentLink11Description: https://datasheet.octopart.com:443/BLM18EG221SN1D-Murata-datasheet-62086310.pdf?src-supplier=Future+Electronics; ComponentLink12URL: https://datasheet.octopart.com/BLM18EG221SN1D-Murata-datasheet-37129980.pdf; ComponentLink12Description: https://datasheet.octopart.com/BLM18EG221SN1D-Murata-datasheet-37129980.pdf; ComponentLink13URL: http://sigma.octopart.com:80/reach_statement/Murata-company-16.pdf?src-supplier=Compliance+Statements; ComponentLink13Description: http://sigma.octopart.com:80/reach_statement/Murata-company-16.pdf?src-supplier=Compliance+Statements
J1 J2 = S2B-PH-SM4-TB(LF)(SN): 2P 1x2P PH Tin -25℃~+85℃ Beige 2mm 100V 2 2A 1 Surface Mount, Right Angle SMD,P=2mm,Surface Mount,Right Angle Headers, Male Pins RoHS; Contact Resistance: 20mΩ; Dielectric Material: Polyamide; Insulation Resistance: 1GΩ; Number of Contacts: 2; Supplier 1: Mouser; Manufacturer: JST; Manufacturer Part Number: S2B-PH-SM4-TB(LF)(SN); RoHS: Compliant; Category: Headers and Wire Housings; Stock 1: 28429; China RoHS: Compliant; Color: Black, White; Connector Type: Male Pin; Contact Gender: Male; Contact Material: Bronze, Copper, Tin; Contact Mating Length: 3.302mm; Contact Plating: Tin; Current Rating: 2A; Depth: 7.6mm; Fastening Type: Detent; Flammability Rating: UL94 V-0; Gender: Male; Height: 5.5mm; Housing Color: Natural; Housing Material: Nylon; Lead Free: Lead Free; Lead Pitch: 2mm; Length: 11.9mm; Lifecycle Status: Production; Material: Polyamide; Max Current Rating: 2A; Max Operating Temperature: 85°C; Max Voltage Rating (AC): 100V; Max Voltage Rating (DC): 100V; Min Operating Temperature: -25°C; Mount: Through Hole; Number of Pins: 2; Number of Poles: 2; Number of Positions: 2; Number of Rows: 1; Packaging: Bulk; Pitch: 2mm; Radiation Hardening: No; REACH SVHC: Yes; Terminal Pitch: 2mm; Termination: Crimp, Solder; Voltage Rating: 100V; Voltage Rating (AC): 100V; Voltage Rating (DC): 100V; Weight: 28.349523g; Width: 2.34mm; Working Voltage: 100V; ComponentLink1URL: https://datasheet.octopart.com:443/S2BPHSM4TBLFSN-JST-datasheet-147762421.pdf?src-supplier=Upverter; ComponentLink1Description: https://datasheet.octopart.com:443/S2BPHSM4TBLFSN-JST-datasheet-147762421.pdf?src-supplier=Upverter; ComponentLink2URL: https://datasheet.octopart.com:443/S2B-PH-SM4-TB%28LF%29%28SN%29-JST-datasheet-10411123.pdf?src-supplier=Upverter; ComponentLink2Description: https://datasheet.octopart.com:443/S2B-PH-SM4-TB%28LF%29%28SN%29-JST-datasheet-10411123.pdf?src-supplier=Upverter; ComponentLink3URL: https://datasheet.octopart.com:443/S2B-PH-SM4-TB%28LF%29%28SN%29-JST-datasheet-8324864.pdf?src-supplier=Upverter; ComponentLink3Description: https://datasheet.octopart.com:443/S2B-PH-SM4-TB%28LF%29%28SN%29-JST-datasheet-8324864.pdf?src-supplier=Upverter; ComponentLink4URL: https://datasheet.octopart.com:443/S2B-PH-SM4-TB%28LF%29%28SN%29-JST-datasheet-180491729.pdf?src-supplier=IHS; ComponentLink4Description: https://datasheet.octopart.com:443/S2B-PH-SM4-TB%28LF%29%28SN%29-JST-datasheet-180491729.pdf?src-supplier=IHS; ComponentLink5URL: https://datasheet.octopart.com:443/S2B-PH-SM4-TB%28LF%29%28SN%29-JST-datasheet-15068535.pdf?src-supplier=SOS+electronic; ComponentLink5Description: https://datasheet.octopart.com:443/S2B-PH-SM4-TB%28LF%29%28SN%29-JST-datasheet-15068535.pdf?src-supplier=SOS+electronic; ComponentLink6URL: https://datasheet.octopart.com:443/S2B-PH-SM4-TB%28LF%29%28SN%29-JST-datasheet-12510261.pdf?src-supplier=TME; ComponentLink6Description: https://datasheet.octopart.com:443/S2B-PH-SM4-TB%28LF%29%28SN%29-JST-datasheet-12510261.pdf?src-supplier=TME; ComponentLink7URL: https://datasheet.octopart.com:443/S2B-PH-SM4-TB%28LF%29%28SN%29-JST-datasheet-56537.pdf?src-supplier=Future+Electronics; ComponentLink7Description: https://datasheet.octopart.com:443/S2B-PH-SM4-TB%28LF%29%28SN%29-JST-datasheet-56537.pdf?src-supplier=Future+Electronics; ComponentLink8URL: https://datasheet.octopart.com:443/S2B-PH-SM4-TB-%28LF%29%28SN%29-JST-datasheet-165061721.pdf?src-supplier=Burklin+Elektronik; ComponentLink8Description: https://datasheet.octopart.com:443/S2B-PH-SM4-TB-%28LF%29%28SN%29-JST-datasheet-165061721.pdf?src-supplier=Burklin+Elektronik; ComponentLink9URL: https://datasheet.octopart.com:443/S2B-PH-SM4-TB%28LF%29%28SN%29-JST-datasheet-515537.pdf?src-supplier=Farnell; ComponentLink9Description: https://datasheet.octopart.com:443/S2B-PH-SM4-TB%28LF%29%28SN%29-JST-datasheet-515537.pdf?src-supplier=Farnell; ComponentLink10URL: https://datasheet.octopart.com:443/S2B-PH-SM4-TB-%28LF%29-%28SN%29-JST-datasheet-159515011.pdf?src-supplier=Amar+Radio+Corporation; ComponentLink10Description: https://datasheet.octopart.com:443/S2B-PH-SM4-TB-%28LF%29-%28SN%29-JST-datasheet-159515011.pdf?src-supplier=Amar+Radio+Corporation
J3 = HC-FPC-0.5-18P-CXH20: CONN FFC FPC 18POS 0.5mm BOTTOM CNT SMD R/A
L1 = XFL4015-471MEC: FIXED IND 470nH SMD,4x4mm
PWR = MK-12C02-G020: Surface Mount, Right Angle 1A SPDT 6V Black 10,000 Cycles SMD,6.6x1.4mm Slide Switches RoHS
Q3-Q5 = AO3402: MOSFET N-CH 30V SOT-23
R1 = RC0402FR-07300RL: RES 300Ω ±1% 62.5mW 0402
R2 = RC0402FR-071K18L: RES 1.18kΩ ±1% 62.5mW 0402
R3 R5 R7 = RC0603FR-071K5L: RES 1.5kΩ ±1% 100mW 0603
R4 = RC0805FR-0720RL: RES 20Ω ±1% 125mW 0805
R6 = RC0402FR-074K12L: RES 4.12kΩ ±1% 62.5mW 0402
R8 R15 R16 R20 R23 = RC0402FR-071KL: RES 1kΩ ±1% 62.5mW 0402; Manufacturer: Yageo Group; Power Rating: 63mW; Temperature Coefficient: 100ppm/°C; Voltage Rating: 50V; Supplier 1: DigiKey; Manufacturer Part Number: RC0402FR-071KL; RoHS: Compliant; Category: Chip SMD Resistors; Stock 1: 3526698; Case/Package: 0402; Case Code (Imperial): 0402; Case Code (Metric): 0402; China RoHS: Non-Compliant; Composition: Thick Film; Depth: 500µm; Height: 350µm; Lead Free: Lead Free; Length: 1mm; Lifecycle Status: Production; Max Operating Temperature: 155°C; Military Standard: Not; Min Operating Temperature: -55°C; Mount: Surface Mount; Number of Pins: 2; Number of Terminals: 2; Packaging: Tape & Reel; Power Dissipation: 62.5mW; REACH SVHC: Yes; Resistance: 1kΩ; Schedule B: 8533210045, 8533210045|8533210045|8533210045|8533210045|8533210045|8533210045|8533210045|8533210045|8533210045|8533210045|8533210045|8533210045|8533210045|8533210045|8533210045|8533210045|8533210045|8533210045|8533210045|8533210045|8533210045|8533210045|8533210045|85; Termination: SMD/SMT; Tolerance: 1%; Voltage Rating (AC): 50V; Voltage Rating (DC): 50V; Width: 500µm; Working Voltage: 50V; ComponentLink1URL: https://datasheet.octopart.com:443/RC0402FR-071KL-Yageo-datasheet-175887523.pdf?src-supplier=IHS; ComponentLink1Description: https://datasheet.octopart.com:443/RC0402FR-071KL-Yageo-datasheet-175887523.pdf?src-supplier=IHS; ComponentLink2URL: https://datasheet.octopart.com:443/RC0402FR-071KL-Yageo-datasheet-164759695.pdf?src-supplier=Upverter; ComponentLink2Description: https://datasheet.octopart.com:443/RC0402FR-071KL-Yageo-datasheet-164759695.pdf?src-supplier=Upverter; ComponentLink3URL: https://datasheet.octopart.com:443/RC0402FR-071KL-Yageo-datasheet-103092701.pdf?src-supplier=Upverter; ComponentLink3Description: https://datasheet.octopart.com:443/RC0402FR-071KL-Yageo-datasheet-103092701.pdf?src-supplier=Upverter; ComponentLink4URL: https://sigma.octopart.com:443/138820526/technical_drawing/Yageo-RC0402FR-071KL.pdf?src-supplier=Upverter; ComponentLink4Description: https://sigma.octopart.com:443/138820526/technical_drawing/Yageo-RC0402FR-071KL.pdf?src-supplier=Upverter; ComponentLink5URL: https://datasheet.octopart.com:443/RC0402FR-071KL-Yageo-datasheet-98239111.pdf?src-supplier=Upverter; ComponentLink5Description: https://datasheet.octopart.com:443/RC0402FR-071KL-Yageo-datasheet-98239111.pdf?src-supplier=Upverter; ComponentLink6URL: https://datasheet.octopart.com:443/RC0402FR-071KL-Yageo-datasheet-10408619.pdf?src-supplier=Newark; ComponentLink6Description: https://datasheet.octopart.com:443/RC0402FR-071KL-Yageo-datasheet-10408619.pdf?src-supplier=Newark; ComponentLink7URL: https://datasheet.octopart.com:443/RC0402FR-071KL-Yageo-datasheet-8324527.pdf?src-supplier=Newark; ComponentLink7Description: https://datasheet.octopart.com:443/RC0402FR-071KL-Yageo-datasheet-8324527.pdf?src-supplier=Newark; ComponentLink8URL: https://datasheet.octopart.com:443/RC0402FR-071KL-Yageo-datasheet-62067350.pdf?src-supplier=Farnell; ComponentLink8Description: https://datasheet.octopart.com:443/RC0402FR-071KL-Yageo-datasheet-62067350.pdf?src-supplier=Farnell; ComponentLink9URL: https://datasheet.octopart.com:443/RC0402FR-071KL-Yageo-datasheet-12531192.pdf?src-supplier=Future+Electronics; ComponentLink9Description: https://datasheet.octopart.com:443/RC0402FR-071KL-Yageo-datasheet-12531192.pdf?src-supplier=Future+Electronics; ComponentLink10URL: https://datasheet.octopart.com:443/RC0402FR-071KL-Yageo-datasheet-137700087.pdf?src-supplier=Future+Electronics; ComponentLink10Description: https://datasheet.octopart.com:443/RC0402FR-071KL-Yageo-datasheet-137700087.pdf?src-supplier=Future+Electronics; ComponentLink11URL: https://datasheet.octopart.com:443/RC0402FR-071KL-Yageo-datasheet-8324255.pdf?src-supplier=Future+Electronics; ComponentLink11Description: https://datasheet.octopart.com:443/RC0402FR-071KL-Yageo-datasheet-8324255.pdf?src-supplier=Future+Electronics; ComponentLink12URL: https://datasheet.octopart.com:443/RC0402FR-071KL-Yageo-datasheet-8329306.pdf?src-supplier=element14; ComponentLink12Description: https://datasheet.octopart.com:443/RC0402FR-071KL-Yageo-datasheet-8329306.pdf?src-supplier=element14; ComponentLink13URL: https://datasheet.octopart.com:443/RC0402FR-071KL-Yageo-datasheet-505231.pdf?src-supplier=element14; ComponentLink13Description: https://datasheet.octopart.com:443/RC0402FR-071KL-Yageo-datasheet-505231.pdf?src-supplier=element14; ComponentLink14URL: https://datasheet.octopart.com:443/RC0402FR-071KL-Yageo-datasheet-175423674.pdf?src-supplier=SOS+electronic; ComponentLink14Description: https://datasheet.octopart.com:443/RC0402FR-071KL-Yageo-datasheet-175423674.pdf?src-supplier=SOS+electronic; ComponentLink15URL: https://datasheet.octopart.com:443/RC0402FR-071KL-Yageo-datasheet-148775077.pdf?src-supplier=TME; ComponentLink15Description: https://datasheet.octopart.com:443/RC0402FR-071KL-Yageo-datasheet-148775077.pdf?src-supplier=TME; ComponentLink16URL: https://datasheet.octopart.com:443/RC0402FR-071KL-Yageo-datasheet-79472498.pdf?src-supplier=Megastar; ComponentLink16Description: https://datasheet.octopart.com:443/RC0402FR-071KL-Yageo-datasheet-79472498.pdf?src-supplier=Megastar; ComponentLink17URL: https://datasheet.octopart.com/RC0402FR-071KL-Yageo-datasheet-73766026.pdf; ComponentLink17Description: https://datasheet.octopart.com/RC0402FR-071KL-Yageo-datasheet-73766026.pdf; ComponentLink18URL: http://sigma.octopart.com:80/rohs_statement/Yageo-company-2.pdf?src-supplier=Compliance+Statements; ComponentLink18Description: http://sigma.octopart.com:80/rohs_statement/Yageo-company-2.pdf?src-supplier=Compliance+Statements; ComponentLink19URL: http://sigma.octopart.com:80/conflict_mineral_statement/Yageo-company-3.pdf?src-supplier=Compliance+Statements; ComponentLink19Description: http://sigma.octopart.com:80/conflict_mineral_statement/Yageo-company-3.pdf?src-supplier=Compliance+Statements
R9 R10 R18 R19 = RC0402FR-075K1L: RES 5.1kΩ ±1% 62.5mW 0402